# EAGLE design V1.0 (Nipun Kanade's conflicted copy 2013-02-16) (EAGLE 6.1)
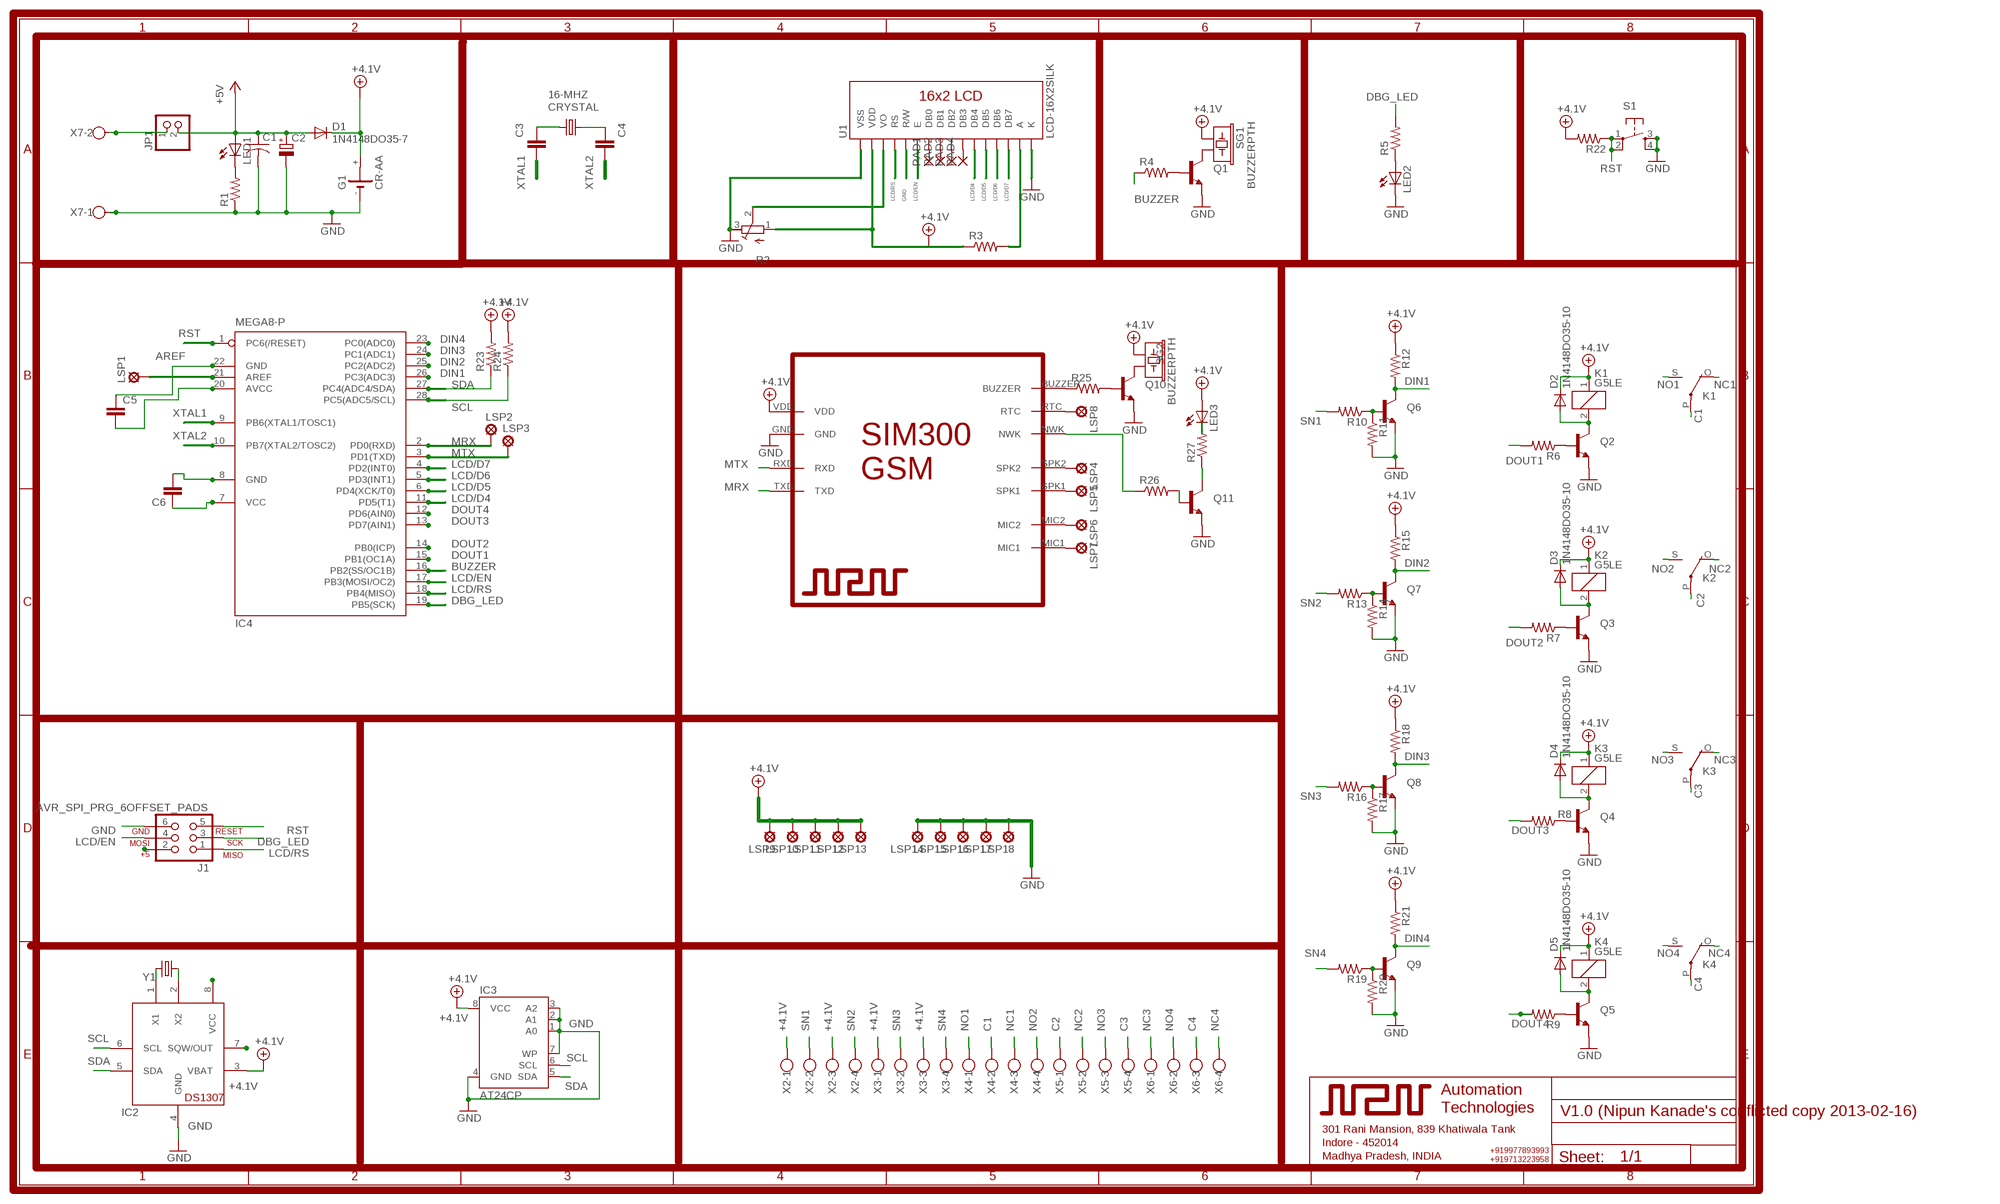
[diagram p0: schematic, sheet 1]

## Parts
C1  C-US050-035X075  [C050-035X075]
C2  CPOL-EUE3.5-8  [E3,5-8]
C3  CAPPTH1  [CAP-PTH-5MM]
C4  CAPPTH1  [CAP-PTH-5MM]
C5  CAPPTH1  [CAP-PTH-5MM]
C6  CAPPTH1  [CAP-PTH-5MM]
CRYSTAL  16-MHZ  CRYSTALHC49UV  [HC49U-V]
D1  1N4148DO35-7  [DO35-7]
D2  1N4148DO35-10  [DO35-10]
D3  1N4148DO35-10  [DO35-10]
D4  1N4148DO35-10  [DO35-10]
D5  1N4148DO35-10  [DO35-10]
G1  CR-AA  [CRAA]
IC2  DS1307  [DIL08]
IC3  AT24CP  [DIL08]
IC4  MEGA8-P  [DIL28-3]
J1  AVR_SPI_PRG_6OFFSET_PADS  [2X3_OFFSET]
JP1  PINHD-1X2  [1X02]
K1  G5LE  [G5LE]
K2  G5LE  [G5LE]
K3  G5LE  [G5LE]
K4  G5LE  [G5LE]
LED1  LED5MM  [LED5MM]
LED2  LED5MM  [LED5MM]
LED3  LED5MM  [LED5MM]
LSP1  LSP11  [LSP11]
LSP2  MCS10B  [MCS10B]
LSP3  MCS10B  [MCS10B]
LSP4  LSP10  [LSP10]
LSP5  LSP10  [LSP10]
LSP6  LSP10  [LSP10]
LSP7  LSP10  [LSP10]
LSP8  LSP10  [LSP10]
LSP9  LSP10  [LSP10]
LSP10  LSP10  [LSP10]
LSP11  LSP10  [LSP10]
LSP12  LSP10  [LSP10]
LSP13  LSP10  [LSP10]
LSP14  LSP10  [LSP10]
LSP15  LSP10  [LSP10]
LSP16  LSP10  [LSP10]
LSP17  LSP10  [LSP10]
LSP18  LSP10  [LSP10]
PAD1  1,6/0,8  [1,6/0,8]
PAD2  1,6/0,8  [1,6/0,8]
PAD3  1,6/0,8  [1,6/0,8]
PAD4  1,6/0,8  [1,6/0,8]
Q1  TRANSISTOR_NPNTO-92-AMMO  [TO-92-AMMO]
Q2  TRANSISTOR_NPNTO-92-AMMO  [TO-92-AMMO]
Q3  TRANSISTOR_NPNTO-92-AMMO  [TO-92-AMMO]
Q4  TRANSISTOR_NPNTO-92-AMMO  [TO-92-AMMO]
Q5  TRANSISTOR_NPNTO-92-AMMO  [TO-92-AMMO]
Q6  TRANSISTOR_NPNTO-92-AMMO  [TO-92-AMMO]
Q7  TRANSISTOR_NPNTO-92-AMMO  [TO-92-AMMO]
Q8  TRANSISTOR_NPNTO-92-AMMO  [TO-92-AMMO]
Q9  TRANSISTOR_NPNTO-92-AMMO  [TO-92-AMMO]
Q10  TRANSISTOR_NPNTO-92-AMMO  [TO-92-AMMO]
Q11  TRANSISTOR_NPNTO-92-AMMO  [TO-92-AMMO]
R1  R-US_0207/10  [0207/10]
R2  R-TRIMM3339P  [RTRIM3339P]
R3  RESISTORPTH-1/4W  [AXIAL-0.4]
R4  R-US_0207/12  [0207/12]
R5  R-US_0207/12  [0207/12]
R6  RESISTORPTH-1/4W  [AXIAL-0.4]
R7  RESISTORPTH-1/4W  [AXIAL-0.4]
R8  RESISTORPTH-1/4W  [AXIAL-0.4]
R9  RESISTORPTH-1/4W  [AXIAL-0.4]
R10  RESISTORPTH-1/4W  [AXIAL-0.4]
R11  RESISTORPTH-1/4W  [AXIAL-0.4]
R12  RESISTORPTH-1/4W  [AXIAL-0.4]
R13  RESISTORPTH-1/4W  [AXIAL-0.4]
R14  RESISTORPTH-1/4W  [AXIAL-0.4]
R15  RESISTORPTH-1/4W  [AXIAL-0.4]
R16  RESISTORPTH-1/4W  [AXIAL-0.4]
R17  RESISTORPTH-1/4W  [AXIAL-0.4]
R18  RESISTORPTH-1/4W  [AXIAL-0.4]
R19  RESISTORPTH-1/4W  [AXIAL-0.4]
R20  RESISTORPTH-1/4W  [AXIAL-0.4]
R21  RESISTORPTH-1/4W  [AXIAL-0.4]
R22  RESISTORPTH-1/4W  [AXIAL-0.4]
R23  RESISTORPTH-1/4W  [AXIAL-0.4]
R24  RESISTORPTH-1/4W  [AXIAL-0.4]
R25  RESISTORPTH-1/4W  [AXIAL-0.4]
R26  RESISTORPTH-1/4W  [AXIAL-0.4]
R27  R-US_0207/15  [0207/15]
S1  TAC_SWITCHPTH  [TACTILE-PTH]
SG1  BUZZERPTH  [BUZZER-12MM]
SG2  BUZZERPTH  [BUZZER-12MM]
U1  LCD-16X2SILK  [LCD-16X2]
U$1  SIM300  [1X10]
X2  W237-4  [W237-4]
X3  W237-4  [W237-4]
X4  W237-4  [W237-4]
X5  W237-4  [W237-4]
X6  W237-4  [W237-4]
X7  W237-102  [W237-102]
Y1  CRYSTALTC38H  [TC38H]

## Nets
+4.1V: C5.2 C6.1 D1.C D2.C D3.C D4.C D5.C G1.+ IC2.3(VBAT) IC2.8(VCC) IC3.8(VCC) IC4.7(VCC) IC4.20(AVCC) J1.2 K1.1 K2.1 K3.1 K4.1 LED3.A LSP9.MP LSP10.MP LSP11.MP LSP12.MP LSP13.MP R2.1(A) R3.P$1 R12.P$1 R15.P$1 R18.P$1 R21.P$1 R22.P$2 R23.P$2 R24.P$2 SG1.+ SG2.+ U1.2(VDD) U$1.VDD X2.1 X2.3 X3.1 X3.3
+5V: C1.1 C2.+ D1.A JP1.2 LED1.A
AREF: IC4.21(AREF) LSP1.MP
BUZZER: IC4.16(PB2(SS/OC1B)) R4.1
C1: K1.P(2:P) X4.2
C2: K2.P(2:P) X5.1
C3: K3.P(2:P) X5.4
C4: K4.P(2:P) X6.3
CRYSTAL: C4.1 CRYSTAL.2
DBG_LED: IC4.19(PB5(SCK)) J1.3 R5.2
DIN1: IC4.26(PC3(ADC3)) Q6.3(C) R12.P$2
DIN2: IC4.25(PC2(ADC2)) Q7.3(C) R15.P$2
DIN3: IC4.24(PC1(ADC1)) Q8.3(C) R18.P$2
DIN4: IC4.23(PC0(ADC0)) Q9.3(C) R21.P$2
DOUT1: IC4.15(PB1(OC1A)) R6.P$2
DOUT2: IC4.14(PB0(ICP)) R7.P$2
DOUT3: IC4.13(PD7(AIN1)) R8.P$2
DOUT4: IC4.12(PD6(AIN0)) R9.P$2
GND: C1.2 C2.- C5.1 C6.2 G1.- IC2.4(GND) IC3.1(A0) IC3.2(A1) IC3.3(A2) IC3.4(GND) IC3.7(WP) IC4.8(GND) IC4.22(GND) J1.6 LED2.K(C) LSP14.MP LSP15.MP LSP16.MP LSP17.MP LSP18.MP Q1.1(E) Q2.1(E) Q3.1(E) Q4.1(E) Q5.1(E) Q6.1(E) Q7.1(E) Q8.1(E) Q9.1(E) Q10.1(E) Q11.1(E) R1.1 R2.3(E) R11.P$2 R14.P$2 R17.P$2 R20.P$2 S1.3 S1.4 U1.1(VSS) U1.5(R/W) U1.16(K) U$1.GND X7.1
LCD/D4: IC4.11(PD5(T1)) U1.11(DB4)
LCD/D5: IC4.6(PD4(XCK/T0)) U1.12(DB5)
LCD/D6: IC4.5(PD3(INT1)) U1.13(DB6)
LCD/D7: IC4.4(PD2(INT0)) U1.14(DB7)
LCD/EN: IC4.17(PB3(MOSI/OC2)) J1.4 U1.6(E)
LCD/RS: IC4.18(PB4(MISO)) J1.1 U1.4(RS)
MRX: IC4.2(PD0(RXD)) LSP2.MP U$1.TXD
MTX: IC4.3(PD1(TXD)) LSP3.MP U$1.RXD
N$1: JP1.1 X7.2
N$2: LED1.K(C) R1.2
N$3: C3.1 CRYSTAL.1
N$4: PAD1.1(P) U1.7(DB0)
N$5: PAD2.1(P) U1.8(DB1)
N$6: R2.2(S) U1.3(VO)
N$7: Q1.3(C) SG1.-
N$8: Q1.2(B) R4.2
N$9: LED2.A R5.1
N$10: D2.A K1.2 Q2.3(C)
N$11: Q2.2(B) R6.P$1
N$12: D3.A K2.2 Q3.3(C)
N$13: Q3.2(B) R7.P$1
N$14: R3.P$2 U1.15(A)
N$15: PAD3.1(P) U1.9(DB2)
N$16: PAD4.1(P) U1.10(DB3)
N$17: D4.A K3.2 Q4.3(C)
N$18: Q4.2(B) R8.P$1
N$19: D5.A K4.2 Q5.3(C)
N$20: Q5.2(B) R9.P$1
N$21: Q6.2(B) R10.P$1 R11.P$1
N$22: LSP4.MP U$1.SPK2
N$23: LSP5.MP U$1.SPK1
N$24: LSP6.MP U$1.MIC2
N$25: Q7.2(B) R13.P$1 R14.P$1
N$26: LSP7.MP U$1.MIC1
N$27: LSP8.MP U$1.RTC
N$28: Q8.2(B) R16.P$1 R17.P$1
N$29: IC2.1(X1) Y1.2
N$30: R25.P$1 U$1.BUZZER
N$31: Q9.2(B) R19.P$1 R20.P$1
N$32: IC2.2(X2) Y1.1
N$33: Q10.2(B) R25.P$2
N$34: Q10.3(C) SG2.-
N$35: Q11.2(B) R26.P$2
N$36: LED3.K(C) R27.2
N$37: R26.P$1 U$1.NWK
N$39: Q11.3(C) R27.1
N$40: IC2.7(SQW/OUT)
NC1: K1.O(2:O) X4.3
NC2: K2.O(2:O) X5.2
NC3: K3.O(2:O) X6.1
NC4: K4.O(2:O) X6.4
NO1: K1.S(2:S) X4.1
NO2: K2.S(2:S) X4.4
NO3: K3.S(2:S) X5.3
NO4: K4.S(2:S) X6.2
RST: IC4.1(PC6(/RESET)) J1.5 R22.P$1 S1.1 S1.2
SCL: IC2.6(SCL) IC3.6(SCL) IC4.28(PC5(ADC5/SCL)) R24.P$1
SDA: IC2.5(SDA) IC3.5(SDA) IC4.27(PC4(ADC4/SDA)) R23.P$1
SN1: R10.P$2 X2.2
SN2: R13.P$2 X2.4
SN3: R16.P$2 X3.2
SN4: R19.P$2 X3.4
XTAL1: C3.2 IC4.9(PB6(XTAL1/TOSC1))
XTAL2: C4.2 IC4.10(PB7(XTAL2/TOSC2))
Unconnected: G1.+@1(+)

## Library data of the parts
C1 = rcl:C-US: CAPACITOR, American symbol
C2 = rcl:CPOL-EU: POLARIZED CAPACITOR, European symbol
C3-C6 = SparkFun_NPN:CAP: Capacitor Standard 0603 ceramic capacitor, and 0.1" leaded capacitor.
CRYSTAL Y1 = SparkFun_NPN:CRYSTAL: Crystals Various standard crystals. Proven footprints. Spark Fun Electronics SKU : COM-00534
D1-D5 = diode:1N4148: DIODE high speed (Philips)
G1 = battery:CR-AA: LI BATTERY Varta CRAA-SLF
IC2 = adafruit:DS1307: DS1307 Real time clock (RTC) with battery backup ability. Talk to it via i2c
IC3 = atmel:AT24C*: 2-wire serial EEPROM; MPN: AT24C1024BW-SH-B; OC_FARNELL: 1362646; OC_NEWARK: 03P2044
IC4 = atmel:MEGA8-P: MICROCONTROLLER 8 Kbytes FLASH, 1 kbytes SRAM, 512 bytes EEPROM, USART, 4-channel 10 bit ADC, 2-channel 8 bit ADC Pin compatible with Atmega48, ATMega88, ATMega168 Source: avr.lbr; OC_FARNELL: unknown; OC_NEWARK: unknown
J1 = SparkFun:AVR_SPI_PRG_6: AVR ISP 6 Pin This is the reduced ISP connector for AVR programming. Common on Arduino. This footprint will take up less PCB space and can be used with a 10-pin to 6-pin adapter such as SKU: BOB-08508
JP1 = pinhead:PINHD-1X2: PIN HEADER
K1-K4 = relay:G5LE: RELAY 1 x switch, 10 A/120 V AC, 8 A/30 V DC, Omron; OC_FARNELL: unknown; OC_NEWARK: unknown
LED1-LED3 = led:LED: LED OSRAM: - CHIPLED LG R971, LG N971, LY N971, LG Q971, LY Q971, LO R971, LY R971 LH N974, LH R974 LS Q976, LO Q976, LY Q976 LO Q996 - Hyper CHIPLED LW Q18S LB Q993, LB Q99A, LB R99A - SideLED LS A670, LO A670, LY A670, LG A670, LP A670 LB A673, LV A673, LT A673, LW A673 LH A674 LY A675 LS A676, LA A676, LO A676, LY A676, LW A676 LS A679, LY A679, LG A679 - Hyper Micro SIDELED® LS Y876, LA Y876, LO Y876, LY Y876 LT Y87S - SmartLED LW L88C, LW L88S LB L89C, LB L89S, LG L890 LS L89K, LO L89K, LY L89K LS L896, LA L896, LO L896, LY L896 - TOPLED LS T670, LO T670, LY T670, LG T670, LP T670 LSG T670, LSP T670, LSY T670, LOP T670, LYG T670 LG T671, LOG T671, LSG T671 LB T673, LV T673, LT T673, LW T673 LH T674 LS T676, LA T676, LO T676, LY T676, LB T676, LH T676, LSB T676, LW T676 LB T67C, LV T67C, LT T67C, LS T67K, LO T67K, LY T67K, LW E67C LS E67B, LA E67B, LO E67B, LY E67B, LB E67C, LV E67C, LT E67C LW T67C LS T679, LY T679, LG T679 LS T770, LO T770, LY T770, LG T770, LP T770 LB T773, LV T773, LT T773, LW T773 LH T774 LS E675, LA E675, LY E675, LS T675 LS T776, LA T776, LO T776, LY T776, LB T776 LHGB T686 LT T68C, LB T68C - Hyper Mini TOPLED® LB M676 - Mini TOPLED Santana® LG M470 LS M47K, LO M47K, LY M47K Source: http://www.osram.convergy.de LUXEON: - LUMILED® LXK2-PW12-R00, LXK2-PW12-S00, LXK2-PW14-U00, LXK2-PW14-V00 LXK2-PM12-R00, LXK2-PM12-S00, LXK2-PM14-U00 LXK2-PE12-Q00, LXK2-PE12-R00, LXK2-PE12-S00, LXK2-PE14-T00, LXK2-PE14-U00 LXK2-PB12-K00, LXK2-PB12-L00, LXK2-PB12-M00, LXK2-PB14-N00, LXK2-PB14-P00, LXK2-PB14-Q00 LXK2-PR12-L00, LXK2-PR12-M00, LXK2-PR14-Q00, LXK2-PR14-R00 LXK2-PD12-Q00, LXK2-PD12-R00, LXK2-PD12-S00 LXK2-PH12-R00, LXK2-PH12-S00 LXK2-PL12-P00, LXK2-PL12-Q00, LXK2-PL12-R00 Source: www.luxeon.com KINGBRIGHT: KA-3528ASYC Source: www.kingbright.com
LSP1 = solpad:LSP11: SOLDER PAD drill 1.1 mm
LSP2 LSP3 = solpad:MCS10B: SOLDER PAD MC S1, distributor Buerklin, 15F505
LSP4-LSP18 = solpad:LSP10: SOLDER PAD drill 1.0 mm, distributor Buerklin, 12H555
PAD1-PAD4 = wirepad:1,6/0,8: THROUGH-HOLE PAD
Q1-Q11 = SparkFun_NPN:TRANSISTOR_NPN: Transistor NPN BJT configuration in SOT23 package. MMBT2222 is the common NPN we use. Double check BCE configuration again layout.
R1 R4 R5 R27 = rcl:R-US_: RESISTOR, American symbol
R2 = rcl:R-TRIMM: Trimm resistor
R3 R6-R26 = SparkFun_NPN:RESISTOR: Resistor Basic schematic elements and footprints for 0603, 1206, and PTH resistors.
S1 = SparkFun_NPN:TAC_SWITCH: Momentary Switch Button commonly used for reset or general input. Spark Fun Electronics SKU : COM-00097
SG1 SG2 = SparkFun_NPN:BUZZER: Buzzer 12mm Spark Fun Electronics SKU : Comp-Buzzer
U1 = SparkFun_NPN:LCD-16X2
U$1 = NPN:SIM300
X2-X6 = con-wago-500:W237-4: WAGO SCREW CLAMP; OC_FARNELL: unknown; OC_NEWARK: unknown
X7 = con-wago-500:W237-102: WAGO SCREW CLAMP; MPN: 237-102; OC_FARNELL: unknown; OC_NEWARK: 70K9898

## Board
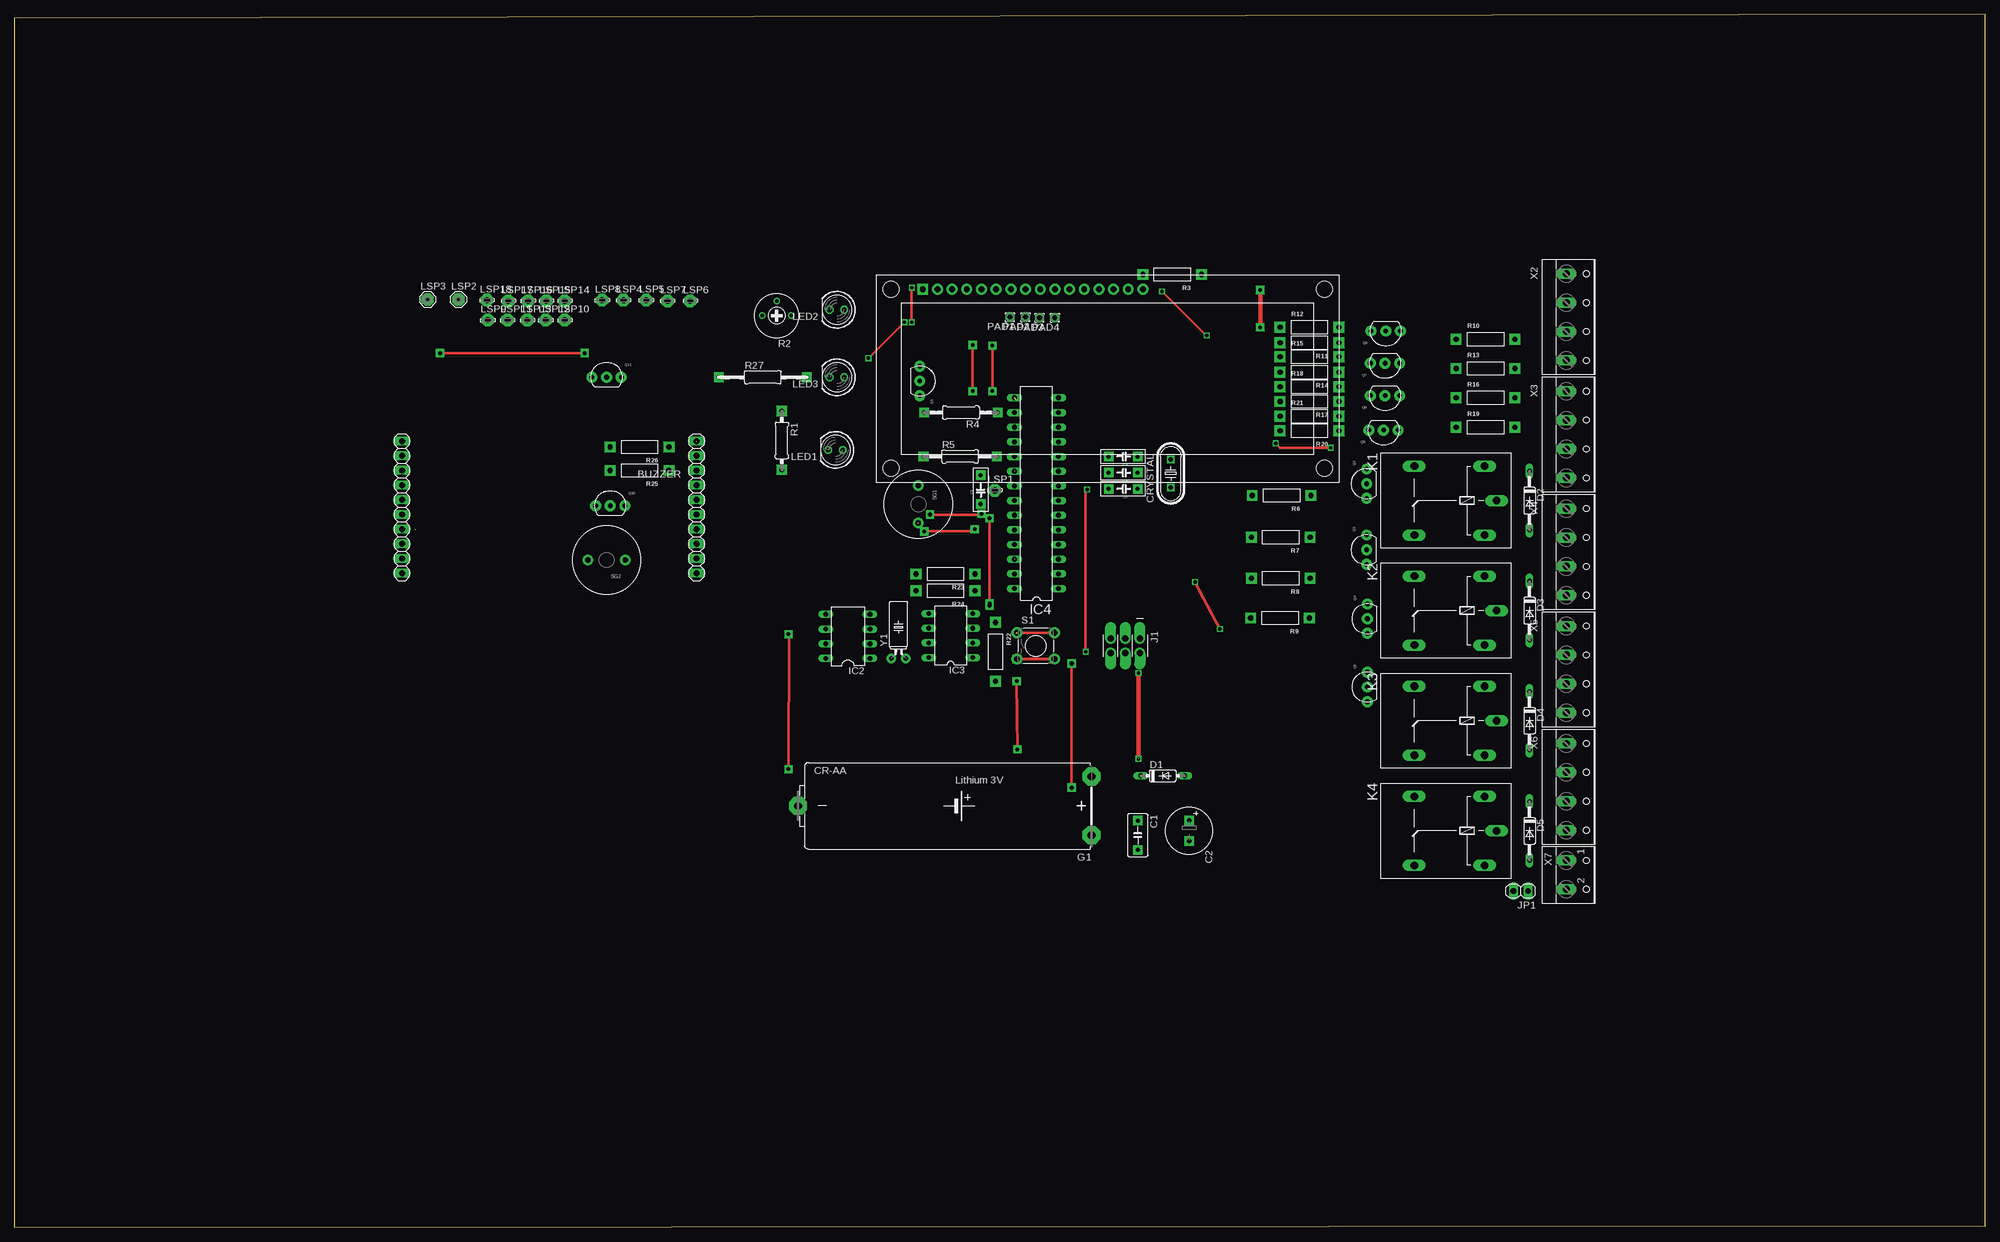
[diagram p1: board, top side]
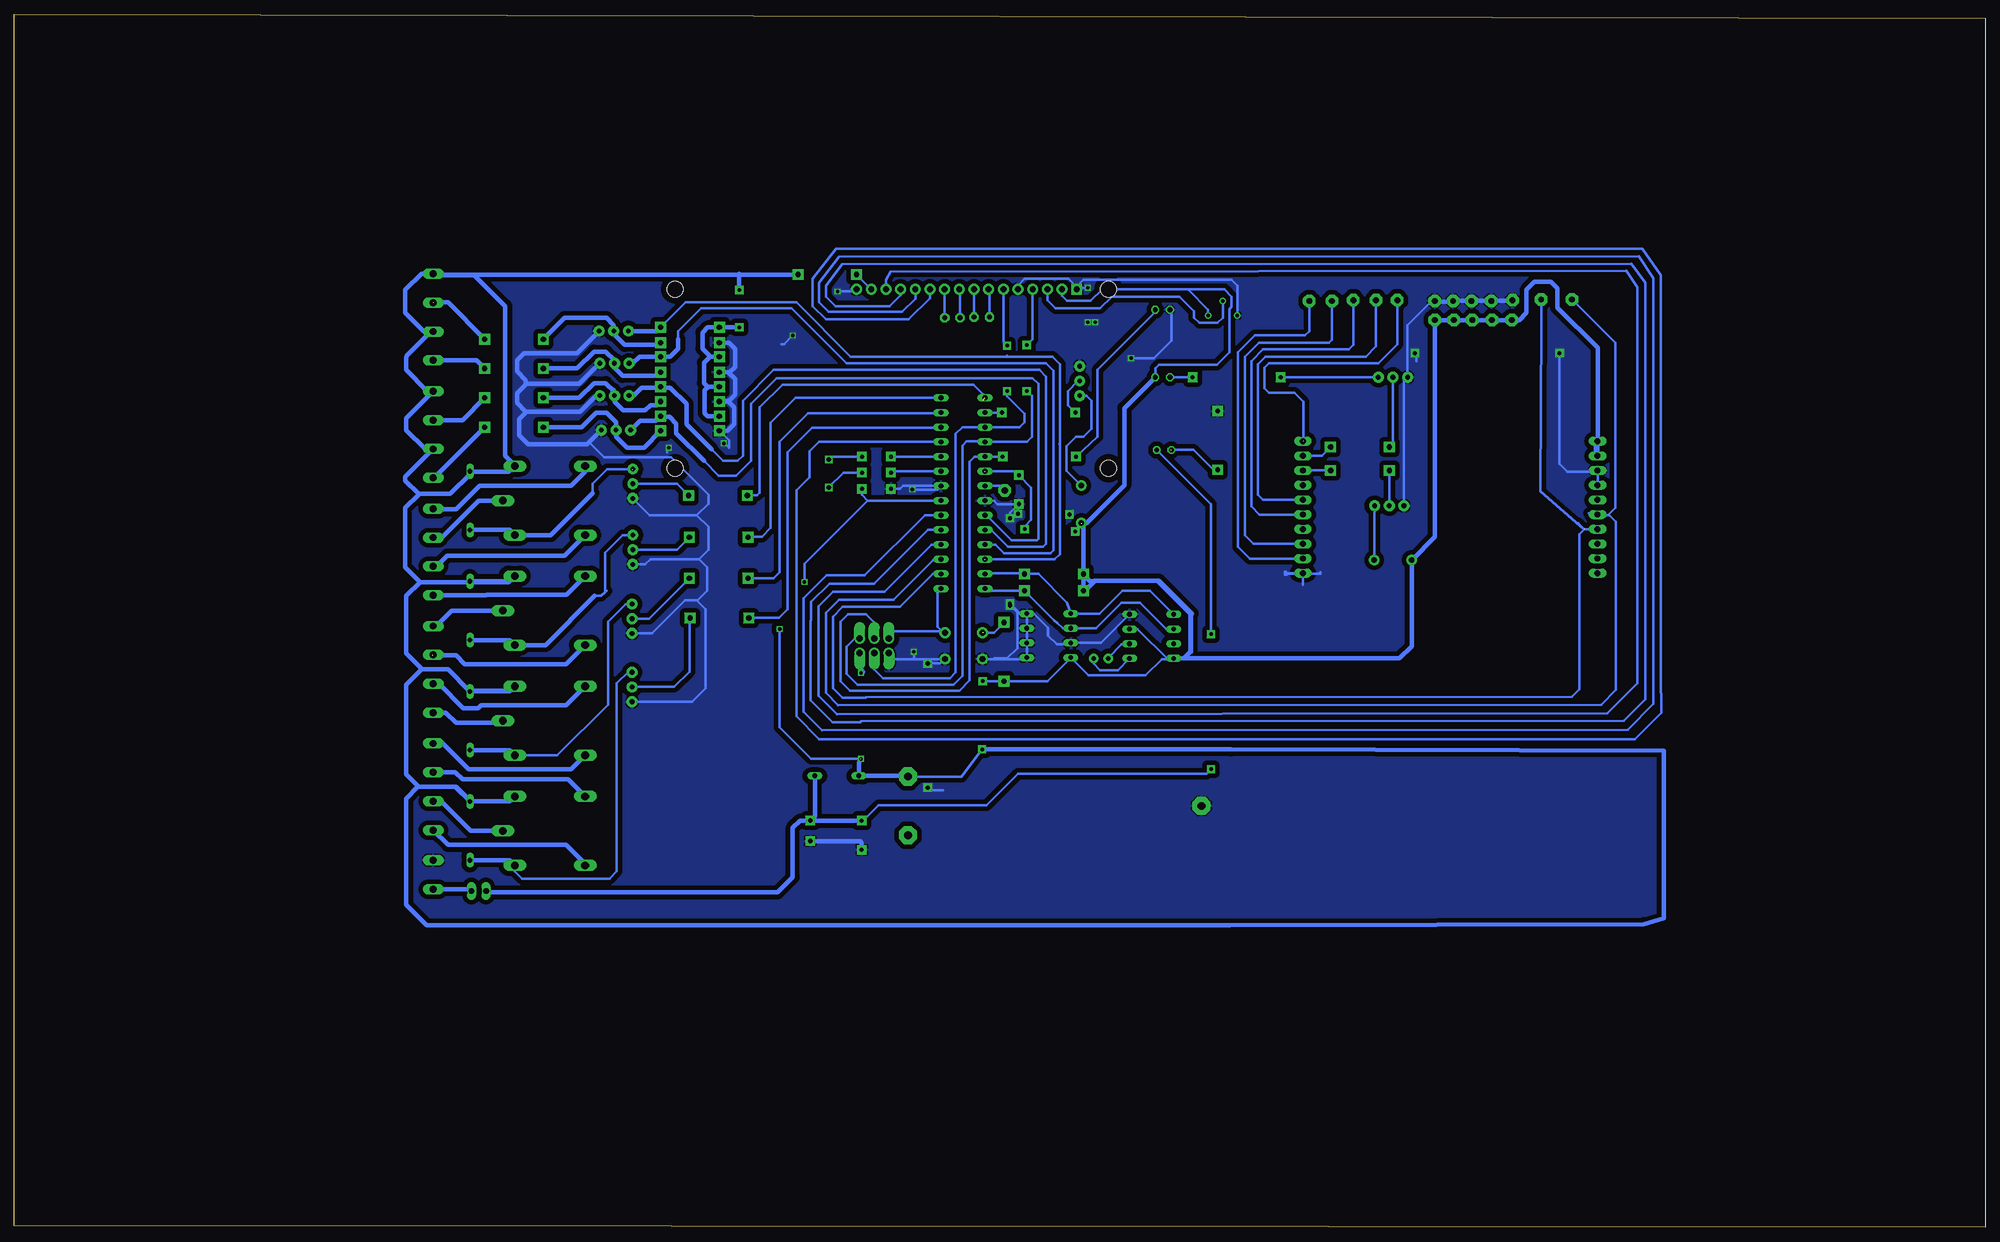
[diagram p2: board, bottom side, seen from below]

Size 341.1 x 209.85 mm. Coordinates in mm from the lower left corner, seen from the top.
Outline: 0,0 341.1,0.25 341.1,209.85 0,209.22 0,0
Copper layers (1*16): Top 0.035mm / dielectric 1.5mm / Bottom 0.035mm
Design rules: minimum track width 10mil, minimum drill 24mil, track to track 8mil, track to pad 8mil, pad to pad 8mil, via to via 8mil, smd to smd 8mil, copper to edge 40mil, drill to drill 8mil, minimum pad ring 10mil, minimum via ring 8mil, stop-mask expansion 4mil, vias tented up to drill 0mil, thermal gap 10mil

### Footprints (pad centres in the part's own frame; a part is rotated, then mirrored left to right if it is on the bottom)
C050-035X075 = drill 0.7 pad 1.676 square: 1 -2.54,0; 2 2.54,0
E3,5-8 = drill 0.813 pad 1.6 square: + -1.778,0; - 1.778,0
CAP-PTH-5MM = drill 0.7 pad 1.651 square: 1 -2.5,0; 2 2.5,0
HC49U-V = drill 0.813 square: 1 -2.413,0; 2 2.413,0
DO35-7 = drill 0.813 long: A 3.81,0; C -3.81,0
DO35-10 = drill 0.813 long: A 5.08,0; C -5.08,0
CRAA = drill 1.321 pad 3.15 octagon: + -25.4,-5.08; +@1 -25.4,5.08; - 25.4,0
DIL08 = drill 0.813 long: 1 -3.81,-3.81; 2 -1.27,-3.81; 3 1.27,-3.81; 4 3.81,-3.81; 5 3.81,3.81; 6 1.27,3.81; 7 -1.27,3.81; 8 -3.81,3.81
DIL28-3 = drill 0.813 long: 1 -16.51,-3.81; 2 -13.97,-3.81; 3 -11.43,-3.81; 4 -8.89,-3.81; 5 -6.35,-3.81; 6 -3.81,-3.81; 7 -1.27,-3.81; 8 1.27,-3.81; 9 3.81,-3.81; 10 6.35,-3.81; 11 8.89,-3.81; 12 11.43,-3.81; 13 13.97,-3.81; 14 16.51,-3.81; 15 16.51,3.81; 16 13.97,3.81; 17 11.43,3.81; 18 8.89,3.81; 19 6.35,3.81; 20 3.81,3.81; 21 1.27,3.81; 22 -1.27,3.81; 23 -3.81,3.81; 24 -6.35,3.81; 25 -8.89,3.81; 26 -11.43,3.81; 27 -13.97,3.81; 28 -16.51,3.81
2X3_OFFSET = drill 1.118 pad 1.88 offset: 1 -2.54,-1.27; 2 -2.54,1.27; 3 0,-1.27; 4 0,1.27; 5 2.54,-1.27; 6 2.54,1.27
1X02 = drill 1.016 long: 1 -1.27,0; 2 1.27,0
G5LE = drill 1.321 long: 1 -7.493,-5.969; 2 -7.493,5.969; O 4.699,5.969; P -9.525,0; S 4.699,-5.969
LED5MM = drill 0.813 octagon: A -1.27,0; K 1.27,0
LSP11 = drill 1.118 pad 2.159 octagon: MP 0,0
MCS10B = drill 1.016 pad 2.159 octagon: MP 0,0
LSP10 = drill 1.016 pad 2.159 octagon: MP 0,0
1,6/0,8 = drill 0.813 pad 1.6 octagon: 1 0,0
TO-92-AMMO = drill 0.813 pad 1.88: 1 -2.54,0; 2 0,0; 3 2.54,0
0207/10 = drill 0.813 pad 1.778 square: 1 -5.08,0; 2 5.08,0
RTRIM3339P = drill 0.61: 1 -2.54,0; 2 0,-2.54; 3 2.54,0
AXIAL-0.4 = drill 0.9 pad 1.88 square: P$1 -5.08,0; P$2 5.08,0
0207/12 = drill 0.7 pad 1.676 square: 1 -6.35,0; 2 6.35,0
0207/15 = drill 0.7 pad 1.676 square: 1 -7.62,0; 2 7.62,0
TACTILE-PTH = drill 1.016 pad 1.88: 1 -3.251,2.261; 2 3.251,2.261; 3 -3.251,-2.261; 4 3.251,-2.261
BUZZER-12MM = drill 0.9 pad 1.778: + 3.25,0; - -3.25,0
LCD-16X2 = drill 1.016 pad 1.88 square: 1 -32,15.5 | drill 1.016 pad 1.88: 2 -29.46,15.5; 3 -26.92,15.5; 4 -24.38,15.5; 5 -21.84,15.5; 6 -19.3,15.5; 7 -16.76,15.5; 8 -14.22,15.5; 9 -11.68,15.5; 10 -9.14,15.5; 11 -6.6,15.5; 12 -4.06,15.5; 13 -1.52,15.5; 14 1.02,15.5; 15 3.56,15.5; 16 6.1,15.5 | hole 2.8: -37.5,15.5; -37.5,-15.5; 37.5,15.5; 37.5,-15.5
1X10 = drill 1.016 long: 17 25.5,3.81; ADC0 -25.5,-11.43; AGND 25.5,-3.81; BUZZER 25.5,6.35; CTS -25.5,-8.89; GND -25.5,6.35; GND1 -25.5,3.81; GND2 25.5,-11.43; MIC1 25.5,-6.35; MIC2 25.5,-8.89; NWK 25.5,8.89; PS-ON -25.5,1.27; RTC 25.5,11.43; RTS -25.5,-6.35; RXD -25.5,-1.27; SPK1 25.5,-1.27; SPK2 25.5,1.27; TXD -25.5,-3.81; VDD -25.5,11.43; VDD1 -25.5,8.89
W237-4 = drill 1.194 long: 1 -7.5,-1.27; 2 -2.5,-1.27; 3 2.5,-1.27; 4 7.5,-1.27
W237-102 = drill 1.194 long: 1 -2.5,-1.27; 2 2.5,-1.27
TC38H = drill 0.813 pad 1.676: 1 -1.27,0; 2 1.27,0

### Placement (x,y rotation side)
C1  194.44,67.82 270 top
C2  203.33,68.58 270 top
C3  191.9,130.56 180 top
C4  191.9,133.35 180 top
C5  167.26,127.64 90 top
C6  191.9,127.76 180 top
CRYSTAL  200.15,130.43 90 top
D1  198.75,78.11 0 top
D2  262.25,125.73 270 top
D3  262.25,106.68 270 top
D4  262.25,87.63 270 top
D5  262.25,68.58 270 top
G1  161.04,72.9 180 top
IC2  144.27,102.23 90 top
IC3  162.05,102.36 90 top
IC4  176.91,127 90 top
J1  192.28,100.58 180 top
JP1  260.73,58.17 180 top
K1  247.01,125.73 180 top
K2  247.01,106.68 180 top
K3  247.01,87.63 180 top
K4  247.01,68.58 180 top
LED1  142.11,134.49 180 top
LED2  142.37,158.75 180 top
LED3  142.37,147.07 180 top
LSP1  169.67,127.51 0 top
LSP2  76.83,160.53 0 top
LSP3  71.5,160.53 0 top
LSP4  105.41,160.4 0 top
LSP5  109.35,160.4 0 top
LSP6  116.97,160.27 0 top
LSP7  113.03,160.27 0 top
LSP8  101.73,160.4 0 top
LSP9  81.92,156.97 0 top
LSP10  95.25,156.97 0 top
LSP11  85.34,156.97 0 top
LSP12  91.95,156.97 0 top
LSP13  88.77,156.97 0 top
LSP14  95.25,160.27 0 top
LSP15  92.08,160.27 0 top
LSP16  88.9,160.27 0 top
LSP17  85.47,160.27 0 top
LSP18  81.79,160.4 0 top
PAD1  172.34,157.48 180 top
PAD2  175.01,157.48 180 top
PAD3  177.42,157.35 180 top
PAD4  180.09,157.35 180 top
Q1  156.72,146.43 270 top
Q2  234.06,128.65 90 top
Q3  234.06,117.22 90 top
Q4  234.19,105.28 90 top
Q5  234.19,93.47 90 top
Q6  237.36,155.07 180 top
Q7  237.24,149.48 180 top
Q8  237.24,143.89 180 top
Q9  236.98,137.92 180 top
Q10  103.12,124.84 0 top
Q11  102.49,147.07 0 top
R1  132.84,136.14 270 top
R2  131.95,157.73 180 top
R3  200.41,164.85 180 top
R4  163.83,140.97 180 top
R5  163.7,133.35 0 top
R6  219.33,126.62 180 top
R7  219.2,119.38 180 top
R8  219.2,112.27 180 top
R9  219.07,105.41 180 top
R10  254.63,153.67 0 top
R11  224.16,153.03 180 top
R12  224.16,155.7 0 top
R13  254.63,148.59 0 top
R14  224.16,147.96 180 top
R15  224.16,150.62 0 top
R16  254.63,143.51 0 top
R17  224.16,142.88 180 top
R18  224.16,145.41 0 top
R19  254.63,138.43 0 top
R20  224.16,137.79 180 top
R21  224.16,140.34 0 top
R22  169.8,99.57 270 top
R23  161.16,113.03 180 top
R24  161.16,110.11 180 top
R25  108.2,130.94 180 top
R26  108.2,135 180 top
R27  129.54,147.07 0 top
S1  176.78,100.58 0 top
SG1  156.46,125.09 270 top
SG2  102.49,115.44 180 top
U1  189.23,146.81 0 top
U$1  92.58,124.59 0 top
X2  269.88,157.48 270 top
X3  269.88,137.16 270 top
X4  269.88,116.84 270 top
X5  269.88,96.52 270 top
X6  269.88,76.2 270 top
X7  269.88,60.96 270 top
Y1  153.03,98.42 0 top

### Tracks (layer width: path | path; a pad name or v marks a point on that pad's centre or on a via)
+4.1V  (via drill 0.6, 0.6 pad 1.42)  (3 unrouted)
  Top 0.406: v173.48,94.49 v173.61,82.68 | v166.24,120.78 165.86,120.4 v157.48,120.4 | v204.34,111.63 v208.66,103.5
  Top 0.813: v215.65,155.7 v215.65,162.18 | v194.56,95.89 v194.56,81.03
  Bottom 0.406: IC4.20 173.01,130.9 | IC2.8 140.59,98.3 | 140.59,98.3 141.48,98.3 | 141.48,98.3 146.69,103.5 IC2.3 | 141.48,98.3 142.49,98.3 145.29,95.5 155.19,95.5 IC3.8 162.31,94.49 R22.P$2 v173.48,94.49 | R23.P$2 156.21,112.9 156.21,109.47 156.08,109.6 R24.P$2 155.96,109.98 155.96,109.6 153.8,111.76 142.88,111.76 137.29,106.17 137.29,99.44 138.43,98.3 140.59,98.3 | 193.42,125.73 194.4,126.71 C6.1 | 159.77,162.06 U1.2 159.77,161.17 158.88,160.27 154.81,160.27 152.78,162.31 137.92,162.31 | 67.18,133.6 67.18,133.35 | 173.1,130.68 173.23,130.81 167.93,130.81 C5.2 165.1,127.98 165.1,122.43 166.12,121.41 166.12,121.28 166.24,121.16 v166.24,120.78 | R3.P$1 205.62,164.98 215.65,164.98 X2.1 | R2.1 134.49,158.75 137.92,162.18 137.92,162.31 | LED3.A 143.64,148.59 143,149.22 132.97,149.22 130.81,151.38 130.81,158.88 130.43,159.26 130.43,161.04 131.7,162.31 137.92,162.31 | v173.61,82.68 177.16,77.98 G1.+ | v157.48,120.4 156.34,121.54 156.34,121.79 | IC4.7 193.42,125.73 | 193.42,125.73 204.34,114.81 v204.34,111.63 | v208.66,103.5 208.66,86.49 203.2,81.03 194.69,81.03
  Bottom 0.813: X2.1 270.64,164.97 273.43,162.18 273.43,158.24 270.26,155.07 269.11,155.07 269.03,154.98 | 269.03,154.98 X2.3 | 269.03,154.98 273.18,150.83 273.18,150.62 273.3,150.5 273.3,148.34 269.63,144.66 X3.1 273.3,139.96 273.3,137.92 270.04,134.66 X3.3 273.43,129.83 273.43,129.16 271.14,126.87 | 262.13,130.68 255.52,130.68 K1.1 254.51,131.83 256.16,133.48 256.16,159.38 261.49,164.72 268.99,164.72 269.11,164.85 205.75,164.85 205.62,164.98 | D3.C 255.4,111.76 K2.1 255.52,111.63 270.89,111.63 | D4.C 255.4,92.71 K3.1 255.27,92.84 262.38,92.84 266.06,96.52 270.51,96.52 | 271.14,126.87 265.68,126.87 262.25,130.3 D2.C | 270.89,111.63 273.43,114.17 273.43,124.46 271.14,126.75 271.14,126.87 | 270.51,96.52 273.3,99.31 273.3,109.22 270.89,111.63 | 262.13,73.66 D5.C 264.8,76.2 | 264.8,76.2 271.14,76.2 | 271.14,76.2 273.3,78.36 273.3,93.85 270.64,96.52 270.51,96.52 | 220.98,145.41 221.11,145.41 221.74,146.05 221.74,149.61 220.73,150.62 R15.P$1 220.6,150.62 222,152.02 222,154.81 221.11,155.7 R12.P$1 v215.65,155.7 | R18.P$1 220.98,145.41 | 220.98,145.41 221.62,144.78 221.62,140.84 221.11,140.34 R21.P$1 | G1.+ 186.56,78.11 D1.C 194.94,80.39 v194.56,81.03 | v215.65,162.18 215.65,164.98 | LED3.A 148.97,141.73 148.97,128.4 155.52,121.84 SG1.+ 156.08,121.46 R23.P$2 | 137.29,106.17 143,111.89 143.26,111.89 | 143.26,111.89 154.05,111.89 | 154.05,111.89 155.7,110.24 155.96,110.24 156.08,110.36 R23.P$2 | R23.P$2 155.96,112.9 155.96,112.78 154.94,111.76 154.31,111.76 154.18,111.89 154.05,111.89 | 143.26,111.89 137.54,106.17 137.54,99.57 138.68,98.42 IC2.8 101.35,98.42 99.24,100.53 SG2.+ 95.25,119.43 LSP10.MP LSP12.MP LSP13.MP LSP11.MP LSP9.MP 80.64,156.97 79.38,158.24 79.38,162.18 77.98,163.58 75.18,163.58 74.04,162.43 74.04,159.13 67.06,152.15 67.06,135.76 67.18,135.64
  Bottom 0.813: K4.1 255.4,73.66 262.13,73.66 | 262.13,73.66 264.67,76.2 264.8,76.2 | 271.14,76.2 271.27,76.2 273.3,74.17 273.3,55.75 269.75,52.2 130.68,52.2 59.05,52.45 55.63,53.47 55.63,82.42 130.56,82.68 v173.61,82.68 | J1.2 194.82,96.77 194.18,96.14 v194.56,95.89
  Bottom 1.016: U$1.VDD 67.18,135.92 67.18,135.64 67.18,133.6
+5V  (via drill 0.6 pad 1.42)
  Top 0.406: v133.99,102.62 134.11,102.49 v133.99,79.25
  Bottom 0.406: LED1.A 133.99,125.09 v133.99,102.62 | v133.99,79.25 134.75,78.49 167.39,78.49 172.85,73.03 191.52,73.03 194.18,70.36 C1.1
  Bottom 0.813: C2.+ 205.1,70.36 206.38,69.09 206.38,60.58 209.04,57.91 259.21,57.91 JP1.2 | C2.+ C1.1 | C2.+ 202.56,71.12 D1.A
AREF
  Bottom 0.406: LSP1.MP 170.43,128.27 IC4.21
BUZZER
  Bottom 0.406: IC4.16 R4.1
C1
  Bottom 0.813: K1.P 260.73,125.73 267.12,119.34 X4.2
C2
  Bottom 0.813: K2.P 265.43,106.68 268.09,104.02 X5.1
C3
  Bottom 0.813: K3.P 256.92,87.25 264.67,87.25 266.44,89.02 X5.4
C4
  Bottom 0.813: X6.3 268.56,73.66 267.21,73.66 262.13,68.58 K4.P
CRYSTAL
  Bottom 0.406: CRYSTAL.2 199.64,133.35 C4.1
DBG_LED
  Bottom 0.406: 173.35,133.35 IC4.19 R5.2 | 173.35,133.35 174.88,133.35 175.77,132.46 175.77,94.61 177.55,92.84 196.47,92.84 198.12,94.49 198.12,104.78 196.85,106.05 193.68,106.05 192.28,104.65 J1.3 | 173.35,133.35 173.23,133.48
DIN1  (1 unrouted)
  Bottom 0.406: 172.34,115.32 172.59,115.57 IC4.26 | 169.29,150.75 169.16,150.62 | R12.P$2 224.92,160.02 205.74,160.02 196.34,150.62 169.16,150.62 | 169.16,150.62 161.42,150.62 160.15,149.35 160.15,135.51 160.21,135.45 160.15,135.38 160.15,116.46 161.04,115.57 173.23,115.57
  Bottom 0.813: R12.P$2 229.87,155.07 Q6.3
DIN2
  Bottom 0.406: 226.19,153.67 226.19,155.07 222.25,159 206.63,159 197.1,149.48 162.56,149.48 161.29,148.21 161.29,117.09 161.8,116.59 169.8,116.59 171.32,118.11 IC4.25
  Bottom 0.813: 229.49,150.62 R15.P$2 227.58,150.62 226.19,152.02 226.19,153.67 | 229.49,150.62 232.92,150.62 234.06,149.48 Q7.3 | 229.49,150.62 229.36,150.5
DIN3
  Bottom 0.406: 172.09,120.78 172.21,120.65 IC4.24 172.09,120.65 169.16,117.73 163.07,117.73 162.56,118.24 162.56,147.19 163.7,148.34 209.68,148.34 215.01,143 215.01,133.48 215.9,132.59 218.44,132.59 220.47,134.62
  Bottom 0.813: Q8.3 233.93,143.89 232.54,145.29 229.36,145.29 R18.P$2 229.11,145.29 227.58,145.29 224.79,142.49 224.79,138.94 220.47,134.62
DIN4
  Bottom 0.406: 173.48,122.81 IC4.23 172.85,123.19 168.53,118.87 164.08,118.87 163.83,119.13 163.83,145.92 164.85,146.94 209.17,146.94 213.61,142.49 213.61,132.59 216.15,130.05 219.2,130.05 221.74,132.59
  Bottom 0.813: Q9.3 232.79,139.57 230,139.57 R21.P$2 229.11,140.21 227.71,140.21 226.57,139.06 226.57,137.41 221.74,132.59
DOUT1  (1 unrouted)
  Bottom 0.406: 173.48,143.13 173.48,144.15 175.13,145.8 208.15,145.8 212.09,141.86 212.09,127.13 212.6,126.62 R6.P$2
DOUT2
  Bottom 0.406: IC4.14 205.87,143.51 210.19,139.19 210.19,121.03 211.71,119.51 214.38,119.51 214.25,119.38 R7.P$2
DOUT3
  Bottom 0.406: IC4.13 180.85,140.84 203.71,140.84 208.66,135.89 208.66,113.28 209.68,112.27 R8.P$2
DOUT4
  Bottom 0.406: IC4.12 180.85,138.3 203.07,138.3 207.26,134.11 207.26,106.93 208.79,105.41 R9.P$2
GND  (via drill 0.6, 0.6 pad 1.42, 0.7 pad 1.42)
  Top 0.406: S1.3 173.56,98.3 180.09,98.3 | v168.78,107.95 v168.78,122.68 v168.78,107.57 | v198.63,161.93 206.25,154.31 v206.38,154.31 | v155.32,162.56 v155.32,156.59 | v185.67,127.64 185.42,127.38 v185.42,99.57 | v218.31,135.64 219.07,134.87 v227.84,134.87 | v147.83,150.37 v154.05,156.59 | v183.01,97.54 v183.01,76.07 | v173.48,98.3 173.51,98.32 S1.4 | v167.39,123.44 167.26,123.32 v158.5,123.32 | v73.66,151.26 v98.68,151.26
  Bottom 0.406: C6.2 187.83,127.76 187.32,128.27 IC4.8 181.36,127.64 v185.67,127.64 | 172.93,125.9 IC4.22 171.58,125.73 170.94,125.09 167.3,125.09 | IC2.4 153.03,101.09 IC3.7 158.5,100.84 160.66,100.84 162.18,102.36 162.18,103.76 164.59,106.17 IC3.4 IC3.3 IC3.2 IC3.1 165.99,98.68 166.37,98.3 173.35,98.3 173.38,98.32 S1.3 | S1.4 180.06,98.3 180.09,98.3 | 180.09,98.3 185.42,98.3 | 185.42,98.3 189.23,98.3 189.74,98.81 J1.6 | 157.23,162.81 156.08,163.96 130.43,163.96 129.41,162.94 R2.3 | 157.23,162.81 157.23,162.18 156.84,162.56 v155.32,162.56 | 67.06,128.14 67.06,130.91 U$1.GND 67.34,130.68 72.26,130.68 73.66,132.08 v73.66,151.26 | Q2.1 231.14,123.19 223.01,123.19 | 223.01,123.19 220.98,121.16 220.98,117.22 222.63,115.57 | Q3.1 231.9,114.68 231.01,115.57 222.63,115.57 | 222.63,115.57 221.23,114.17 221.23,110.11 222.88,108.46 223.01,108.46 | Q4.1 230.76,102.74 225.04,108.46 223.01,108.46 | 223.01,108.46 221.49,106.93 221.49,93.22 223.77,90.93 Q5.1 | U1.5 167.39,162.94 166.24,164.08 158.62,164.08 157.35,162.81 157.23,162.81 | Q10.1 100.58,146.43 Q11.1 99.95,156.08 95.89,160.15 | 167.3,125.09 168.78,123.61 v168.78,122.68 | v168.78,107.95 167.13,106.3 165.99,106.3 | 223.01,123.19 220.98,125.22 220.98,126.75 227.46,133.22 239.01,133.22 241.43,135.64 241.81,135.64 | U1.16 195.72,161.93 v198.63,161.93 | v206.38,154.31 207.9,152.78 208.28,152.78 | v155.32,156.59 155.32,156.21 | v185.42,99.57 185.42,98.3 | R20.P$2 217.42,136.14 217.42,134.87 218.19,135.64 v218.31,135.64 | v227.84,134.87 228.09,134.62 228.09,134.11 | LED2.K 140.84,158.5 140.84,153.42 143.89,150.37 v147.83,150.37 | 154.05,156.72 v154.05,156.59 154.05,156.34
  Bottom 0.406: 180.09,98.3 180.85,97.54 v183.01,97.54 | v183.01,76.07 182.5,75.56 180.34,75.56 | 167.3,125.09 C5.1 167.39,125.01 v167.39,123.44 | v168.78,107.57 167.51,106.3 167.51,100.2 169.29,98.42 171.45,98.42 171.58,98.3 v173.48,98.3 | v158.5,123.32 157.99,123.83 157.99,123.95 | 117.98,112.9 118.11,112.9 | 118.11,112.9 118.11,111.12 | 118.11,112.9 118.11,113.16 120.9,113.16 120.9,112.9 121.16,112.9 121.16,113.41 121.03,113.41 121.03,113.03 115.06,113.03 115.06,113.28 | v98.68,151.26 98.42,151 98.42,149.86
  Bottom 0.813: Q6.1 243.71,151.26 252.86,151.26 254.13,149.99 254.13,148.08 252.6,146.56 252.6,145.8 | Q7.1 243.33,145.92 252.48,145.92 252.6,145.8 | Q9.1 241.81,135.64 241.94,135.51 252.22,135.51 253.75,137.03 253.75,139.83 252.48,141.1 | 252.48,141.1 243.21,141.1 240.41,143.89 Q8.1 | 252.6,145.8 254.13,144.27 254.13,142.62 252.6,141.1 252.48,141.1 | R11.P$2 217.42,153.03 216.41,152.02 216.41,148.84 217.3,147.96 217.55,147.96 | R14.P$2 217.55,147.96 | 217.55,147.96 216.41,146.81 216.41,144.02 217.55,142.88 R17.P$2 218.95,143 217.68,143 216.53,141.86 216.53,138.94 217.68,137.79 R20.P$2 | C2.- 194.69,66.8 194.44,66.55 C1.2 | LSP18.MP 81.92,160.27 LSP17.MP LSP16.MP LSP15.MP 92.2,160.15 95.89,160.15
  pour Bottom (isolate 0.813): 46.61,177.04 284.48,177.04 284.48,44.7 46.61,44.7
LCD/D4
  Bottom 0.406: U1.11 182.63,160.78 186.31,157.1 200.66,157.1 202.95,159.38 202.95,164.08 198.88,169.29 59.31,169.29 56.13,164.72 56.13,92.46 56.01,92.33 56.01,89.03 60.58,84.45 201.8,84.45 205.74,88.39 205.74,127.51 203.45,129.79 203.45,134.24 201.8,135.89 IC4.11
LCD/D5
  Bottom 0.406: U1.12 185.17,160.66 187.45,158.37 200.15,158.37 201.8,160.02 201.8,163.45 198.37,167.89 59.94,168.02 57.4,164.21 57.4,90.55 61.85,86.11 201.29,85.98 204.47,89.15 204.47,108.84 200.53,112.78 193.93,112.78 183.51,123.19 IC4.6
LCD/D6
  Bottom 0.406: IC4.5 183.01,120.65 192.28,111.38 200.03,111.38 203.2,108.2 203.2,105.03 203.33,104.9 203.33,91.19 199.52,87.38 194.69,87.38 194.56,87.5 62.48,87.63 58.8,91.31 58.8,163.45 61.21,166.75 197.87,166.62 200.66,162.94 200.66,161.04 199.01,159.38 189.61,159.38 187.71,161.29 U1.13
LCD/D7
  Bottom 0.406: U1.14 190.25,163.96 189.48,165.35 62.1,165.48 60.2,162.69 60.2,94.11 65.41,88.9 198.75,88.77 201.93,91.95 201.93,107.44 199.39,109.98 190.5,109.98 182.37,118.11 IC4.4
LCD/EN  (via drill 0.6 pad 1.42)
  Top 0.406: v169.29,144.65 v169.29,152.53
  Bottom 0.406: J1.4 192.28,96.52 190.75,95 179.2,95 178.18,96.01 178.18,137.29 177.04,138.43 IC4.17 167.13,138.43 166.24,139.32 166.24,140.72 169.29,143.76 v169.29,144.65 | v169.29,152.53 169.93,153.17 U1.6
LCD/RS  (via drill 0.6 pad 1.42)
  Top 0.406: v165.86,144.65 v165.86,152.65
  Bottom 0.406: J1.1 195.71,101.85 197.1,100.46 197.1,95.76 195.2,93.85 178.56,93.85 177.04,95.38 177.04,135.25 176.28,136.02 173.23,136.02 IC4.18 165.86,135.89 164.97,136.78 164.97,143.89 165.74,144.65 v165.86,144.65 | v165.86,152.65 164.85,153.67 U1.4
MRX  (1 unrouted)
  Bottom 0.406: IC4.2 182.12,113.03 187.83,107.31 197.74,107.31 199.39,105.66 199.39,93.22 197.74,91.57 193.8,91.57 193.68,91.69 71.5,91.82 70.23,93.09 70.23,119.89 69.34,120.78 | 69.34,120.78 U$1.TXD | 69.34,120.78 70.36,121.79 | LSP2.MP 76.83,156.46 76.96,127.38 69.47,120.78
MTX
  Bottom 0.406: 68.58,123.57 67.34,123.57 U$1.RXD 66.96,123.19 65.28,123.19 | 65.28,123.19 65.02,123.19 63.88,122.05 63.88,92.96 66.42,90.42 198.5,90.3 200.66,92.46 200.66,106.3 198.37,108.58 188.98,108.58 182.12,115.44 180.85,115.44 IC4.3 | 65.28,123.19 64.01,124.46 64.01,153.03 LSP3.MP
N$1
  Bottom 0.813: JP1.1 262.3,58.46 X7.2
N$2  (1 unrouted)
  Bottom 0.406: 140.97,134.49 137.03,134.49 133.6,131.06 R1.2
N$3
  Bottom 0.406: CRYSTAL.1 197.61,130.56 C3.1
N$4
  Bottom 0.406: U1.7 172.34,162.18 PAD1.1
N$5
  Bottom 0.406: U1.8 PAD2.1
N$6
  Bottom 0.406: U1.3 162.31,160.41 160.91,159 153.16,159 151.13,161.04 139.45,161.04 136.91,158.5 136.91,157.35 136.02,156.46 132.84,156.46 131.95,157.35 R2.2
N$7
  Bottom 0.406: 156.46,144.15 Q1.3 155.57,143.89 154.69,143 154.69,138.18 156.08,136.78 157.35,136.78 159,135.13 159,130.88 SG1.-
N$8
  Bottom 0.406: Q1.2 156.97,146.43 158.75,144.65 158.75,142.24 R4.2
N$9
  Bottom 0.406: R5.1 153.67,136.78 153.67,148.34 143.64,158.37 LED2.A
N$10  (1 unrouted)
  Bottom 0.406: 241.05,127 241.05,128.65 238.51,131.19 234.19,131.19 234.06,131.06
  Bottom 0.813: D2.A 255.4,120.65 K1.2 248.28,119.76 241.05,127
N$11
  Bottom 0.406: R6.P$1 226.44,128.65 Q2.2
N$12
  Bottom 0.406: 238.63,110.11 238.89,109.86 | 238.89,109.86 239.52,109.22 240.66,109.22 | Q3.3 235.84,119.76 238.89,116.71 238.89,109.86
  Bottom 0.813: D3.A 255.4,101.6 K2.2 249.17,100.71 240.66,109.22
N$13
  Bottom 0.406: R7.P$1 226.44,117.22 Q3.2
N$14
  Bottom 0.406: R3.P$2 U1.15
N$15
  Bottom 0.406: U1.9 177.42,162.18 PAD3.1
N$16
  Bottom 0.406: U1.10 PAD4.1
N$17
  Bottom 0.406: Q4.3 235.33,107.82 238.38,104.78 238.38,90.42 247.14,81.66 K3.2
  Bottom 0.813: K3.2 255.4,82.55 D4.A
N$18
  Bottom 0.406: R8.P$1 231.27,105.28 Q4.2
N$19
  Bottom 0.406: Q5.3 234.31,96.14 234.82,96.14 236.85,94.11 236.85,61.59 238.12,60.33 253.24,60.33 254.51,61.59 K4.2
  Bottom 0.813: K4.2 255.4,63.5 D5.A
N$20
  Bottom 0.406: R9.P$1 224.28,105.28 224.28,96.14 226.95,93.47 Q5.2
N$21
  Bottom 0.813: R10.P$1 245.87,157.35 238.63,157.35 237.36,156.08 Q6.2 237.36,154.56 235.46,152.65 229.62,152.65 R11.P$1
N$22
  Bottom 0.406: LSP4.MP 105.41,152.4 107.19,150.62 124.59,150.62 125.86,149.35 125.86,126.75 124.97,125.86 U$1.SPK2
N$23
  Bottom 0.406: LSP5.MP 109.35,152.65 110.11,151.89 124.97,151.89 127,149.86 127,124.71 125.6,123.32 U$1.SPK1
N$24
  Bottom 0.406: LSP6.MP 116.97,155.07 117.73,154.31 126.36,154.31 129.29,151.38 129.29,117.73 127.25,115.7 U$1.MIC2
N$25
  Bottom 0.813: R13.P$1 243.71,148.59 240.79,151.51 238.76,151.51 237.24,149.99 Q7.2 237.49,149.48 237.74,149.22 235.84,147.32 229.87,147.32 R14.P$1
N$26
  Bottom 0.406: LSP7.MP 113.03,153.54 113.54,153.03 125.73,153.03 128.14,150.62 128.14,119.76 126.62,118.24 U$1.MIC1
N$27  (1 unrouted)
  Bottom 0.406: 117.98,136.02 117.98,142.88 119.51,144.4 123.95,144.4 124.71,145.16 124.71,148.72 123.95,149.48 105.03,149.48 101.73,152.78 LSP8.MP
N$28
  Bottom 0.813: Q8.2 237.36,144.02 237.36,144.91 | R16.P$1 243.33,143.51 240.79,146.05 238.76,146.05 237.24,144.53 Q8.2 | R17.P$1 229.87,142.24 231.01,142.24 231.9,141.35 235.71,141.35 237.24,142.88 Q8.2
N$29
  Bottom 0.406: IC2.1 150.11,96.39 153.16,96.39 154.31,97.54 Y1.2
N$30
  Bottom 0.406: R25.P$1 U$1.BUZZER
N$31
  Bottom 0.813: R19.P$1 242.95,138.43 240.41,140.97 238.63,140.97 236.98,139.32 Q9.2 236.98,136.78 235.08,134.87 232.16,134.87 R20.P$1
N$32
  Bottom 0.406: IC2.2 148.21,100.84 149.48,100.84 151.76,98.55 Y1.1
N$33
  Bottom 0.406: R25.P$2 Q10.2
N$34
  Bottom 0.406: SG2.- 105.66,115.52 Q10.3
N$35
  Bottom 0.406: R26.P$2 102.49,135.64 Q11.2
N$36
  Bottom 0.406: R27.2 LED3.K
N$37
  Bottom 0.406: R26.P$1 114.81,133.48 U$1.NWK
N$39
  Bottom 0.406: Q11.3 R27.1
NC1
  Bottom 0.813: K1.O 245.87,116.2 266.19,116.2 268.06,114.34 X4.3
NC2  (1 unrouted)
  Bottom 0.813: K2.O 245.62,97.41 263.14,97.41 264.67,98.93 268.73,98.93
NC3
  Bottom 0.813: X6.1 268.6,83.69 266.95,83.69 262.51,79.25 244.73,79.25 K3.O
NC4
  Bottom 0.813: X6.4 266.07,66.17 245.62,66.17 242.32,62.87 K4.O
NO1
  Bottom 0.813: X4.1 268.47,124.21 264.67,124.21 260.6,128.27 244.73,128.27 242.32,130.68 K1.S
NO2
  Bottom 0.813: K2.S 245.49,109.47 259.33,109.47 259.47,109.34 X4.4
NO3
  Bottom 0.813: K3.S 245.62,90.3 260.35,90.3 260.86,89.79 263.4,89.79 267.63,94.02 X5.3
NO4  (1 unrouted)
  Bottom 0.813: K4.S 245.24,77.47 263.52,77.47 264.8,78.74 268.61,78.74
RST  (1 unrouted)
  Top 0.406: S1.1 S1.2
  Bottom 0.406: J1.5 189.74,103 189.61,103.12 180.31,103.12 S1.2 180.31,102.84 181.36,103.89 181.36,109.86 IC4.1 | R22.P$1 171.58,102.87 173.35,102.87
SCL
  Bottom 0.406: IC4.28 172.72,110.11 R24.P$1 161.16,105.03 160.53,104.52 159.64,103.63 IC3.6 153.92,103.63 149.48,108.08 146.3,108.08 141.73,103.5 IC2.6
SDA
  Bottom 0.406: IC4.27 172.97,113.16 166.12,113.16 R23.P$1 166.24,112.78 165.99,113.03 163.83,113.03 158.88,108.08 IC3.5 153.29,106.17 149.35,110.11 144.53,110.11 IC2.5
SN1  (1 unrouted)
  Bottom 0.813: R10.P$2 266.06,160.02 268.61,160.02
SN2
  Bottom 0.813: R13.P$2 261.11,149.98 X2.4
SN3
  Bottom 0.813: R16.P$2 263.56,139.66 X3.2
SN4
  Bottom 0.813: R19.P$2 268.49,129.66 X3.4
XTAL1
  Bottom 0.406: IC4.9 189.4,130.81 C3.2
XTAL2  (1 unrouted)
  Bottom 0.406: IC4.10 189.36,133.35 189.36,133.22